# EAGLE design SimulatorT2PowerRevD (EAGLE 7.7.0)
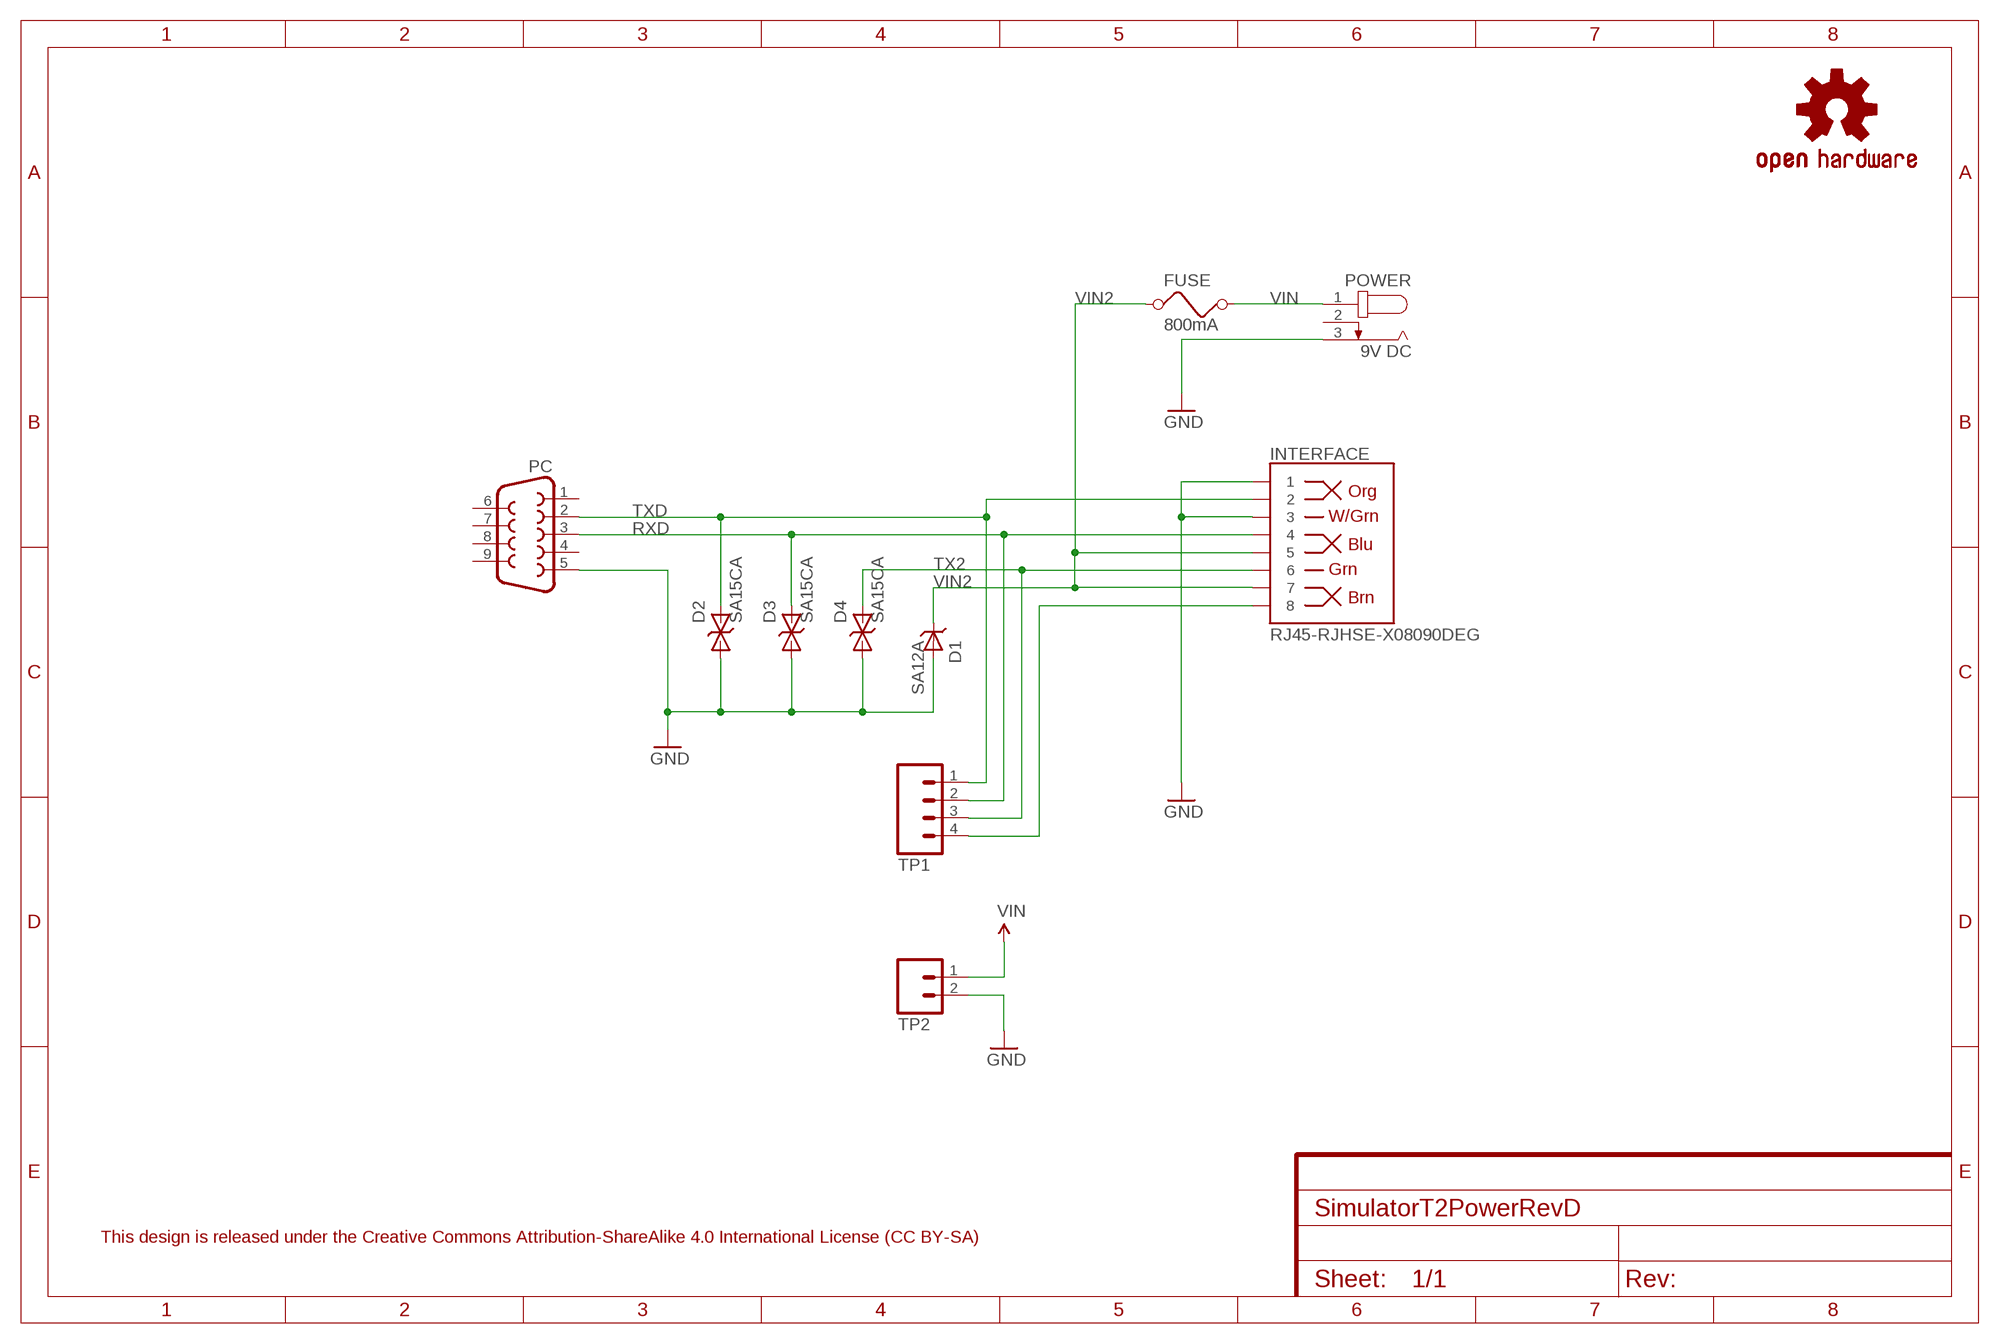
[diagram p0: schematic, sheet 1]
FRAME1 (FRAME-A4L): CNAME: Simulator Type 2 Power; CREVISION: Rev D 07/2019; DESIGNER: A J Instone-Cowie

## Parts
D1  SA12A  [DO41_TVS_UNI]
D2  SA15CA  [DO41_TVS_BI]
D3  SA15CA  [DO41_TVS_BI]
D4  SA15CA  [DO41_TVS_BI]
FUSE  800mA  FUSE-HOLDER-PCB  [MCOMP-FUSE-HOLDER-PCB]
INTERFACE  RJ45-RJHSE-X08090DEG  [RJ45-RJHSE-5080]
LOGO1  OSHW-LOGOS  [OSHW-LOGO-S]
PC  DB9-CONNECTOR-PCBFEMALE  [MULTICOMP-DB9-FEMALE-PCB-90DEG]
POWER  9V DC  DC-POWER-JACK-PCB  [CLIFF-FC681465P-DC-JACK]
TP1  M04PTH  [1X04]
TP2  M02PTH  [1X02]

## Nets
GND: D1.ANODE D2.A D3.A D4.A INTERFACE.1 INTERFACE.3 PC.5 POWER.3 TP2.2
P8: INTERFACE.8 TP1.4
RXD: D3.C INTERFACE.4 PC.3 TP1.2
TX2: D4.C INTERFACE.6 TP1.3
TXD: D2.C INTERFACE.2 PC.2 TP1.1
VIN: FUSE.2 POWER.1 TP2.1
VIN2: D1.CATHODE FUSE.1 INTERFACE.5 INTERFACE.7
Unconnected: PC.1 PC.4 PC.6 PC.7 PC.8 PC.9 POWER.2

## Notes on the sheet
- This design is released under the Creative Commons Attribution-ShareAlike 4.0 International License (CC BY-SA)

## Library data of the parts
D1 = AIC_Custom:SA12A: SA12A TVS Uni-Directional Transient Voltage Suppressor. 12V, DO41 package
D2-D4 = AIC_Custom:SA15CA: SA15CA TVS Bi-Directional Transient Voltage Suppressor. 15V, DO41 package
FUSE = AIC_Custom:FUSE-HOLDER-PCB: FUSE HOLDER Multicomp PCB Mount Fuse Holder 5 x 20 mm MC000827
INTERFACE = AIC_Custom:RJ45-RJHSE-X080: Amphenol RJHSE-x080 RJ45 PCB Jack RJ45 8-pin connection PCB PTH connector, 90 degree and vertical mounting packages
LOGO1 = SparkFun-Aesthetics:OSHW-LOGO: Open Source Hardware Logo This logo indicates the piece of hardware it is found on incorporates a OSHW license and/or adheres to the definition of open source hardware found here: http://freedomdefined.org/OSHW
PC = AIC_Custom:DB9-CONNECTOR-PCB: DB9 Connector Multicomp PCB Right-Angle DB9 Connector Female 5504F1-09S-02A-03
POWER = AIC_Custom:DC-POWER-JACK-PCB: DC Power Jack PCB Mount Cliff FC681465P
TP1 = SparkFun-Connectors:M04: Header 4 Standard 4-pin 0.1" header. Use with straight break away headers (SKU : PRT-00116), right angle break away headers (PRT-00553), swiss pins (PRT-00743), machine pins (PRT-00117), and female headers (PRT-00115). Molex polarized connector foot print use with SKU : PRT-08231 with associated crimp pins and housings. 1MM SMD Version SKU: PRT-10208
TP2 = SparkFun-Connectors:M02: Standard 2-pin 0.1" header. Use with - straight break away headers ( PRT-00116) - right angle break away headers (PRT-00553) - swiss pins (PRT-00743) - machine pins (PRT-00117) - female headers (PRT-00115) Molex polarized connector foot print use with: PRT-08233 with associated crimp pins and housings. 2.54_SCREWTERM for use with PRT-10571. 3.5mm Screw Terminal footprints for PRT-08084 5mm Screw Terminal footprints for use with PRT-08432

## Board
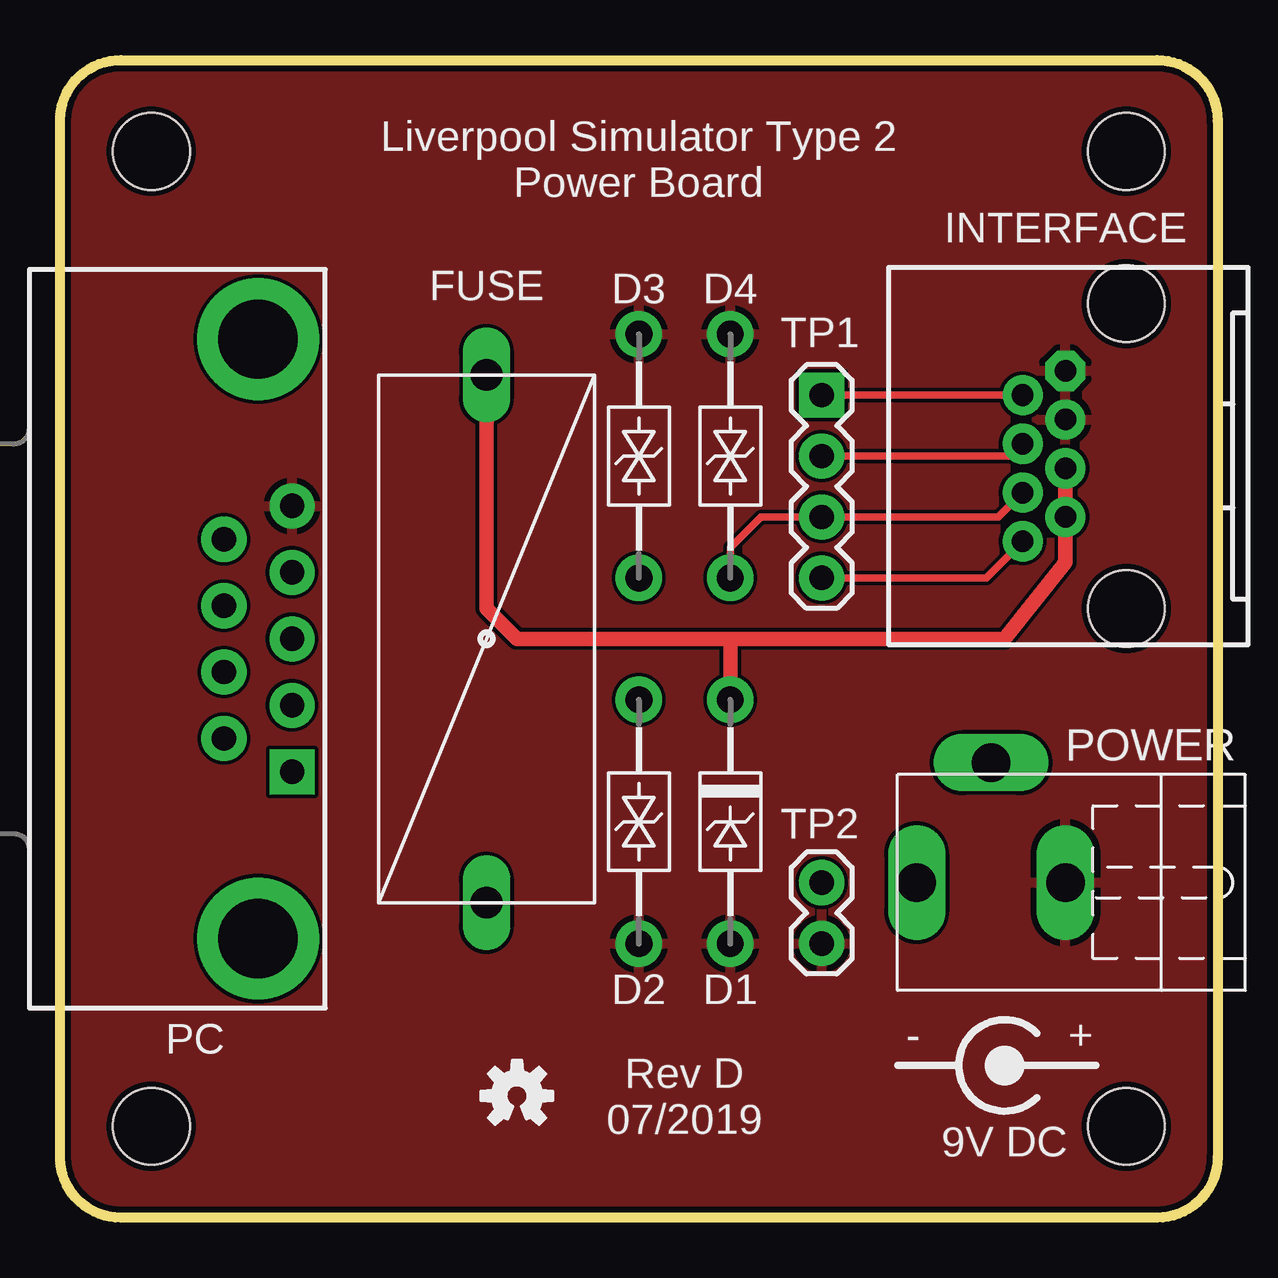
[diagram p1: board, top side]
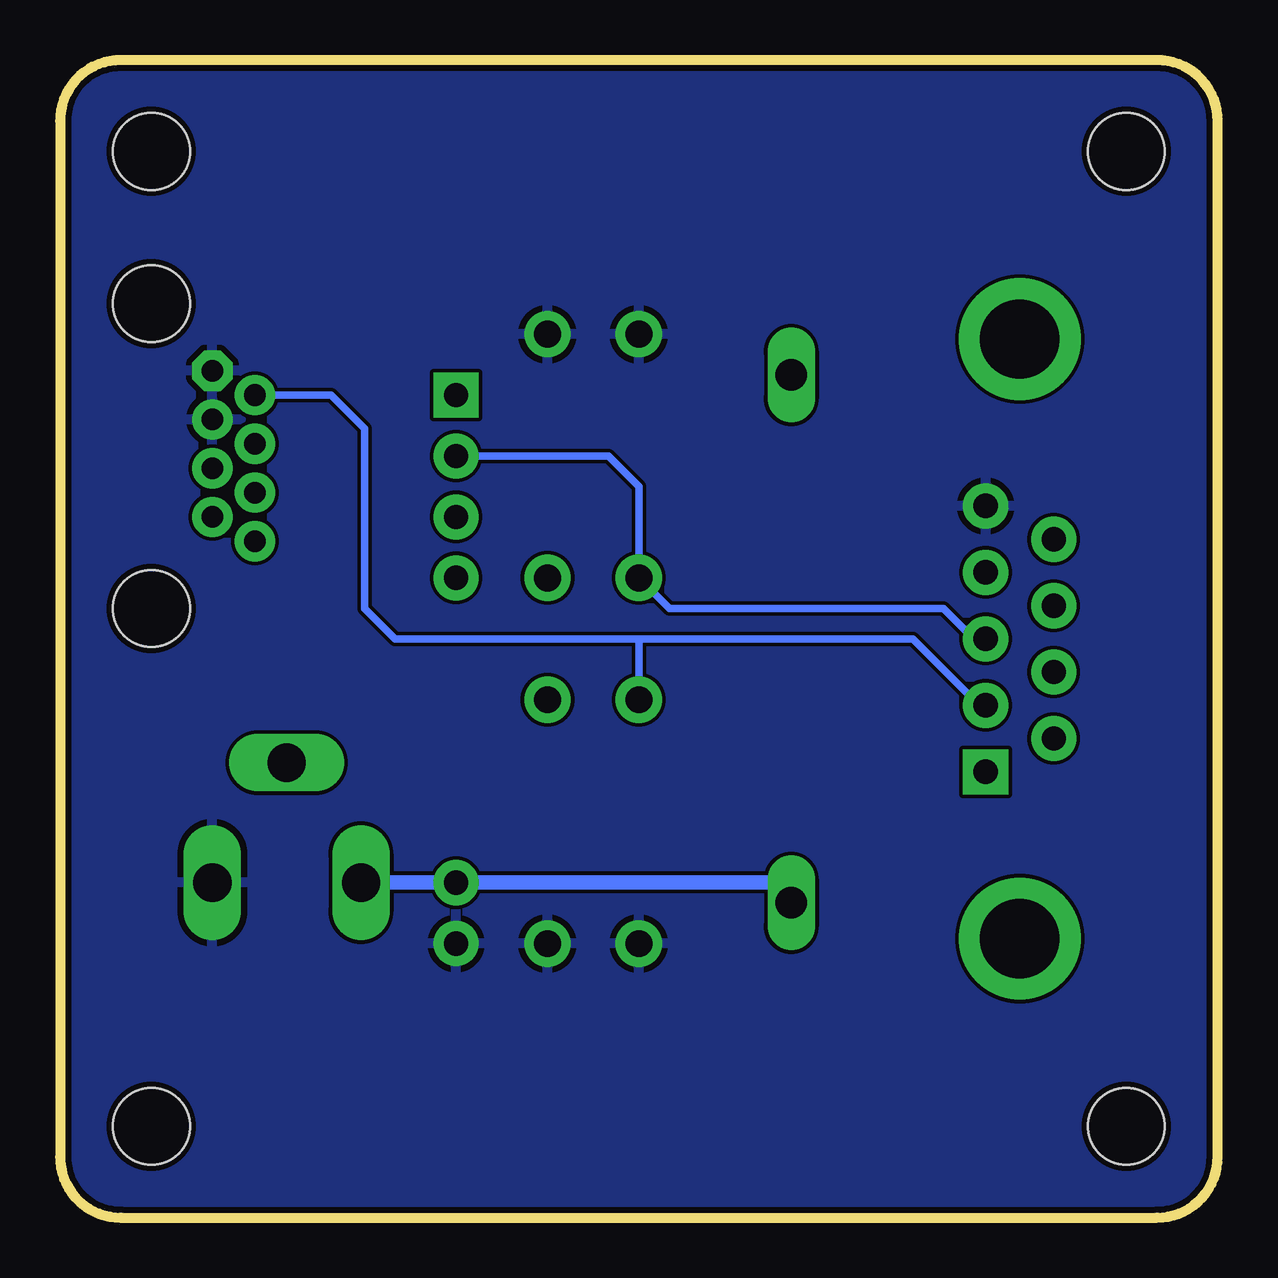
[diagram p2: board, bottom side, seen from below]

Size 48.26 x 48.26 mm. Coordinates in mm from the lower left corner, seen from the top.
Outline: 0,2.54 0,45.72 arc-90 2.54,48.26 45.72,48.26 arc-90 48.26,45.72 48.26,2.54 arc-90 45.72,0 2.54,0 arc-90 0,2.54
Copper layers (1*16): Top 0.035mm / dielectric 1.5mm / Bottom 0.035mm
Design rules "SeeedStudio_2layer_DRU_no_angle_20140221": minimum track width 6mil, minimum drill 12mil, track to track 6mil, track to pad 6mil, pad to pad 6mil, via to via 6mil, smd to smd 0mil, copper to edge 10mil, drill to drill 10mil, minimum pad ring 10mil, minimum via ring 6mil, stop-mask expansion 2mil, vias tented up to drill 100mil, thermal gap 10mil
Holes 3.2 mm at 3.81,3.81 3.81,44.45 44.45,44.45 44.45,3.81

### Footprints (pad centres in the part's own frame; a part is rotated, then mirrored left to right if it is on the bottom)
DO41_TVS_UNI = drill 1.118 pad 1.93: ANODE -5.08,0; CATHODE 5.08,0
DO41_TVS_BI = drill 1.118 pad 1.93: A 5.08,0; C -5.08,0
MCOMP-FUSE-HOLDER-PCB = drill 1.321 long: 1 -11.001,0; 2 11.001,0
RJ45-RJHSE-5080 = drill 0.9 pad 1.676 octagon: 1 3.556,2.54 | drill 0.9 pad 1.676: 2 2.54,4.318; 3 1.524,2.54; 4 0.508,4.318; 5 -0.508,2.54; 6 -1.524,4.318; 7 -2.54,2.54; 8 -3.556,4.318 | hole 3.2: -6.35,0; 6.35,0
MULTICOMP-DB9-FEMALE-PCB-90DEG = drill 1.016 pad 1.88 square: 1 -5.54,-10.945 | drill 1.016 pad 1.88: 2 -2.77,-10.945; 3 0,-10.945; 4 2.77,-10.945; 5 5.54,-10.945; 6 -4.15,-8.105; 7 -1.38,-8.105; 8 1.38,-8.105; 9 4.15,-8.105 | drill 3.302 pad 5.08: G1 -12.496,-9.525; G2 12.496,-9.525
CLIFF-FC681465P-DC-JACK = drill 1.6 long: 1 6.2,0; 2 3.099,-5.001; 3 0,0
1X04 = drill 1.016 pad 1.88 square: 1 0,0 | drill 1.016 pad 1.88: 2 2.54,0; 3 5.08,0; 4 7.62,0
1X02 = drill 1.016 pad 1.88: 1 0,0; 2 2.54,0

### Placement (x,y rotation side)
D1  27.94,16.51 90 top
D2  24.13,16.51 270 top
D3  24.13,31.75 90 top
D4  27.94,31.75 90 top
FUSE  17.78,24.13 270 top
INTERFACE  44.45,31.75 90 top
LOGO1  19.05,5.08 0 top
PC  -1.27,24.13 90 top
POWER  41.91,13.97 180 top
TP1  31.75,34.29 270 top
TP2  31.75,13.97 270 top
U$1  [CENTRE-POS-SILK]  39.37,6.35 0 top

### Tracks (layer width: path | path; a pad name or v marks a point on that pad's centre or on a via)
GND
  pour Bottom: 2.54,48.26 45.72,48.26 arc-90 48.26,45.72 48.26,2.54 arc-90 45.72,0 2.54,0 arc-90 0,2.54 0,45.72 arc-90
  pour Top: 2.54,48.26 45.72,48.26 arc-90 48.26,45.72 48.26,2.54 arc-90 45.72,0 2.54,0 arc-90 0,2.54 0,45.72 arc-90
P8
  Top 0.305: TP1.4 38.61,26.67 INTERFACE.8
RXD
  Top 0.305: TP1.2 39.62,31.75 INTERFACE.4
  Bottom 0.305: TP1.2 25.4,31.75 24.13,30.48 D3.C 22.86,25.4 11.43,25.4 10.16,24.13 PC.3
TX2
  Top 0.305: INTERFACE.6 39.12,29.21 TP1.3 29.21,29.21 27.94,27.94 D4.C
TXD
  Top 0.305: TP1.1 INTERFACE.2
  Bottom 0.305: INTERFACE.2 36.96,34.29 35.56,32.89 35.56,25.4 34.29,24.13 24.13,24.13 | 24.13,24.13 12.7,24.13 9.93,21.36 PC.2 | D2.C 24.13,24.13
VIN
  Bottom 0.61: POWER.1 TP2.1 18.62,13.97 FUSE.2
VIN2
  Top 0.61: INTERFACE.5 INTERFACE.7 41.91,27.3 39.37,24.13 27.94,24.13 | 27.94,24.13 19.05,24.13 17.78,25.4 FUSE.1 | D1.CATHODE 27.94,24.13

### Text on the board
tPlace: Liverpool Simulator Type 2 / Power Board | Rev D / 07/2019